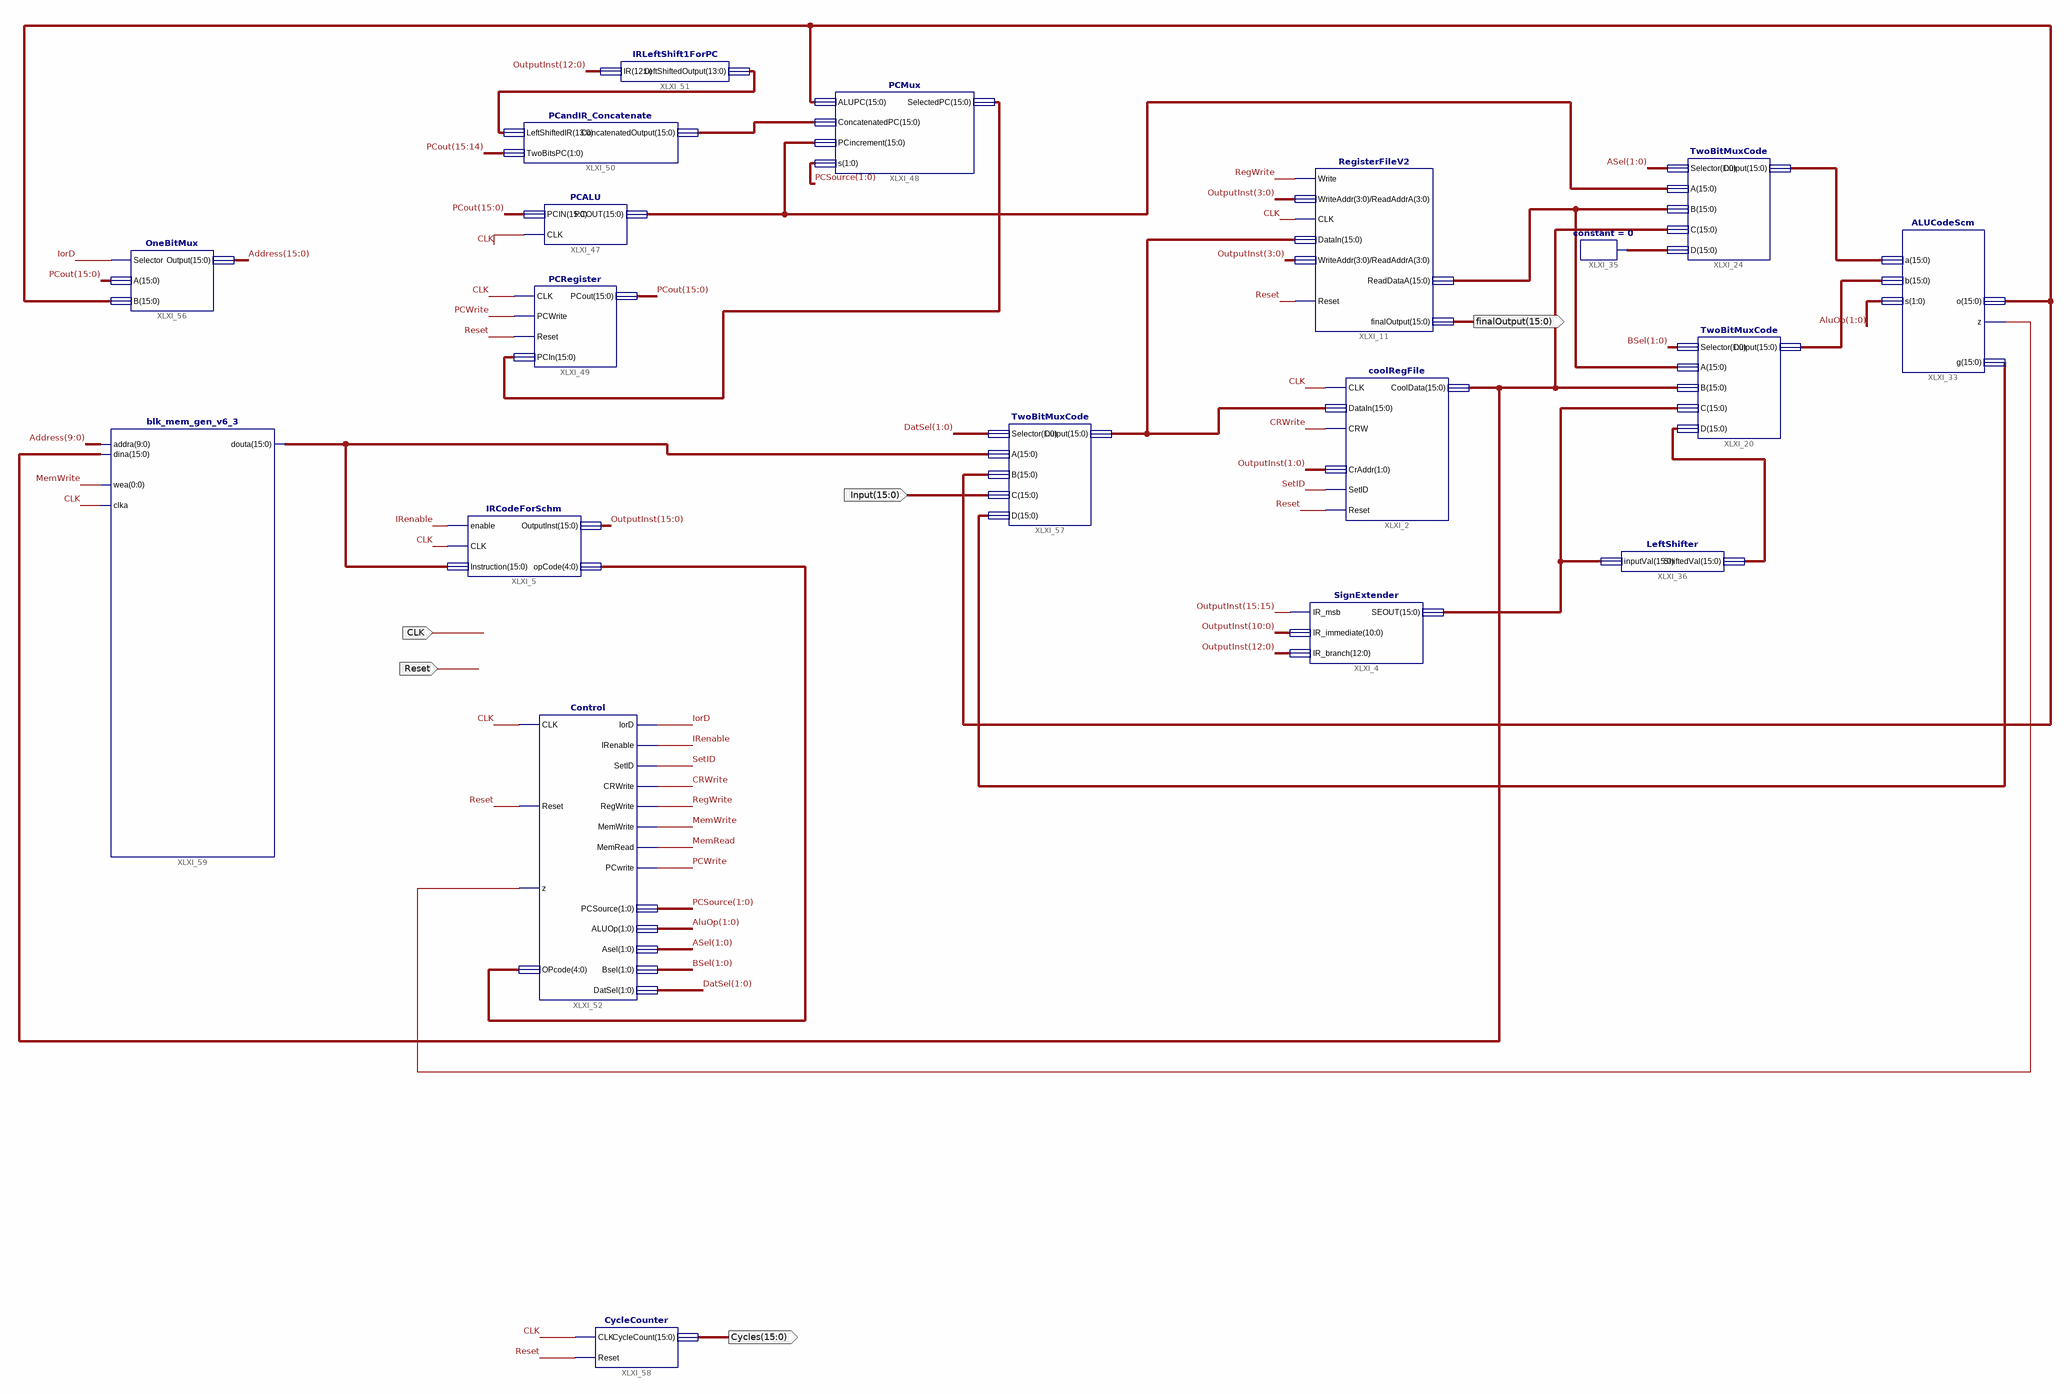
[diagram p0: schematic sheet 1]
// Xilinx ISE schematic FullSystemSchm.sch (spartan3e) as structural Verilog: 19 symbols, 5 ports
module FullSystemSchm (
  input  CLK,
  input  [15:0] Input,
  input  Reset,
  output [15:0] Cycles,
  output [15:0] finalOutput
);

  wire CRWrite, IorD, IRenable, MemRead, MemWrite, PCWrite, RegWrite, SetID, XLXN_193;
  wire [1:0] AluOp, ASel, BSel, DatSel, PCSource;
  wire [4:0] opCode;
  wire [13:0] XLXN_138;
  wire [15:0] Address, CoolData, OutputInst, PCout, XLXN_67, XLXN_68, XLXN_72, XLXN_73, XLXN_84, XLXN_85,
       XLXN_132, XLXN_133, XLXN_135, XLXN_176, XLXN_190, XLXN_191, XLXN_208;

  SignExtender XLXI_4 (
    .IR_msb(OutputInst[15]), .IR_immediate(OutputInst[10:0]), .IR_branch(OutputInst[12:0]), .SEOUT(XLXN_68));
  coolRegFile XLXI_2 (
    .Reset(Reset), .CLK(CLK), .DataIn(XLXN_190), .CRW(CRWrite), .CrAddr(OutputInst[1:0]), .SetID(SetID),
    .CoolData(CoolData));
  RegisterFileV2 XLXI_11 (
    .Write(RegWrite), .WriteAddr(OutputInst[3:0]), .CLK(CLK), .DataIn(XLXN_190), .Reset(Reset),
    .ReadAddrA(OutputInst[3:0]), .ReadDataA(XLXN_67), .finalOutput(finalOutput));
  TwoBitMuxCode XLXI_24 (.Selector(ASel), .A(XLXN_133), .B(XLXN_67), .C(CoolData), .D(XLXN_84), .Output(XLXN_73));
  TwoBitMuxCode XLXI_20 (.Selector(BSel), .A(XLXN_67), .B(CoolData), .C(XLXN_68), .D(XLXN_85), .Output(XLXN_72));
  ALUCodeScm XLXI_33 (.a(XLXN_73), .b(XLXN_72), .s(AluOp), .z(XLXN_193), .o(XLXN_176), .g(XLXN_191));
  constant #(.CValue("0")) XLXI_35 (.O(XLXN_84));
  LeftShifter XLXI_36 (.inputVal(XLXN_68), .ShiftedVal(XLXN_85));
  PCALU XLXI_47 (.PCIN(PCout), .PCOUT(XLXN_133), .CLK(CLK));
  PCMux XLXI_48 (
    .ALUPC(XLXN_176), .ConcatenatedPC(XLXN_135), .PCincrement(XLXN_133), .s(PCSource), .SelectedPC(XLXN_132));
  PCRegister XLXI_49 (.CLK(CLK), .PCWrite(PCWrite), .Reset(Reset), .PCIn(XLXN_132), .PCout(PCout));
  PCandIR_Concatenate XLXI_50 (.LeftShiftedIR(XLXN_138), .TwoBitsPC(PCout[15:14]), .ConcatenatedOutput(XLXN_135));
  IRLeftShift1ForPC XLXI_51 (.IR(OutputInst[12:0]), .LeftShiftedOutput(XLXN_138));
  Control XLXI_52 (
    .CLK(CLK), .Reset(Reset), .z(XLXN_193), .OPcode(opCode), .IorD(IorD), .IRenable(IRenable), .SetID(SetID),
    .CRWrite(CRWrite), .RegWrite(RegWrite), .MemWrite(MemWrite), .MemRead(MemRead), .PCwrite(PCWrite),
    .PCSource(PCSource), .ALUOp(AluOp), .Asel(ASel), .Bsel(BSel), .DatSel(DatSel));
  OneBitMux XLXI_56 (.Selector(IorD), .A(PCout), .B(XLXN_176), .Output(Address));
  IRCodeForSchm XLXI_5 (.enable(IRenable), .CLK(CLK), .Instruction(XLXN_208), .OutputInst(OutputInst), .opCode(opCode));
  TwoBitMuxCode XLXI_57 (.Selector(DatSel), .A(XLXN_208), .B(XLXN_176), .C(Input), .D(XLXN_191), .Output(XLXN_190));
  CycleCounter XLXI_58 (.CLK(CLK), .Reset(Reset), .CycleCount(Cycles));
  blk_mem_gen_v6_3 XLXI_59 (.addra(Address[9:0]), .dina(CoolData), .wea(MemWrite), .clka(CLK), .douta(XLXN_208));
endmodule
